# EAGLE design leo_shield (EAGLE 7.1.0)
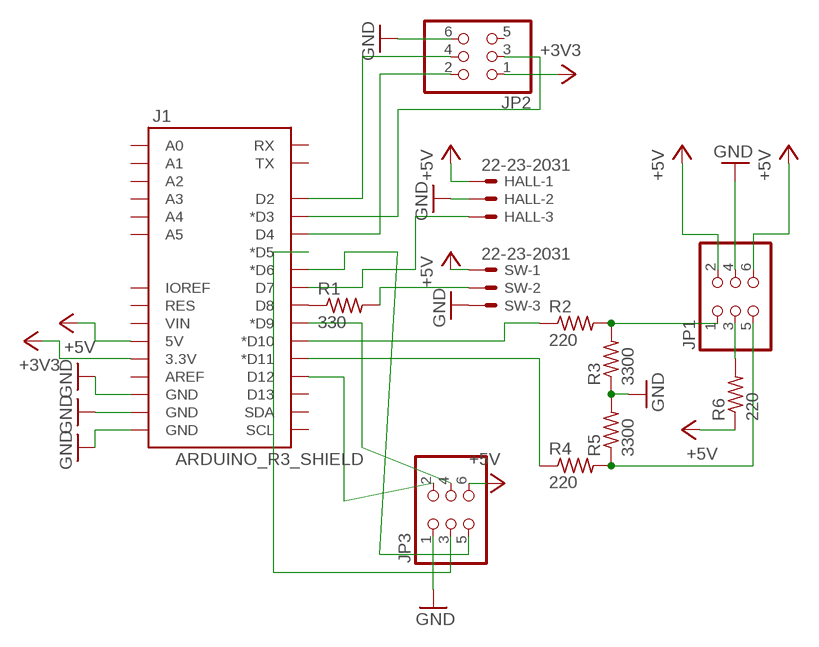
[diagram p0: schematic, sheet 1]

## Parts
HALL  22-23-2031  [22-23-2031]
J1  ARDUINO_R3_SHIELD  [UNO_R3_SHIELD]
JP1  PINHD-2X3  [2X03]
JP2  PINHD-2X3  [2X03]
JP3  PINHD-2X3  [2X03]
R1  330  R-US_0204/7  [0204/7]
R2  220  R-US_0204/7  [0204/7]
R3  3300  R-US_0204/7  [0204/7]
R4  220  R-US_0204/7  [0204/7]
R5  3300  R-US_0204/7  [0204/7]
R6  220  R-US_0204/7  [0204/7]
SW  22-23-2031  [22-23-2031]

## Nets
+3V3 [power]: J1.3.3V JP2.1
+5V [power]: HALL.1 J1.5V JP1.2 JP1.6 JP3.6 R6.1 SW.1
GND [power]: HALL.2 J1.GND@0(GND) J1.GND@1(GND) J1.GND@2(GND) JP1.4 JP2.6 JP3.1 R3.1 R5.2 SW.3
IR: JP1.1 R2.2 R3.2
N$1: J1.D12 JP3.2
N$2: JP1.3 R6.2
N$4: R1.2 SW.2
N$5: J1.D11(*D11) R4.1
N$6: J1.D8 R1.1
N$7: HALL.3 J1.D7
N$8: JP1.5 R4.2 R5.1
N$10: J1.D4 JP2.2
N$11: J1.D2 JP2.4
N$12: J1.D3(*D3) JP2.3
N$13: J1.D10(*D10) R2.1
N$14: J1.D9(*D9) JP3.4
N$15: J1.D5(*D5) JP3.3
N$16: J1.D6(*D6) JP3.5
Unconnected: J1.A0 J1.A1 J1.A2 J1.A3 J1.A4 J1.A5 J1.AREF J1.D13 J1.IOREF J1.RES J1.RX J1.SCL J1.SDA J1.TX J1.VIN JP2.5

## Library data of the parts
HALL SW = con-molex:22-23-2031: .100" (2.54mm) Center Header - 3 Pin; MF: MOLEX; MPN: 22-23-2031; OC_FARNELL: 1462950; OC_NEWARK: 30C0862
J1 = SparkFun-Boards:ARDUINO_R3_SHIELD: Shield form compatible with the Arduino Uno R3.
JP1-JP3 = pinhead:PINHD-2X3: PIN HEADER
R1-R6 = resistor:R-US_: RESISTOR, American symbol

## Net classes
1 power: width 0.914 mm, drill 0.406 mm, clearance 0.406 mm

## Board
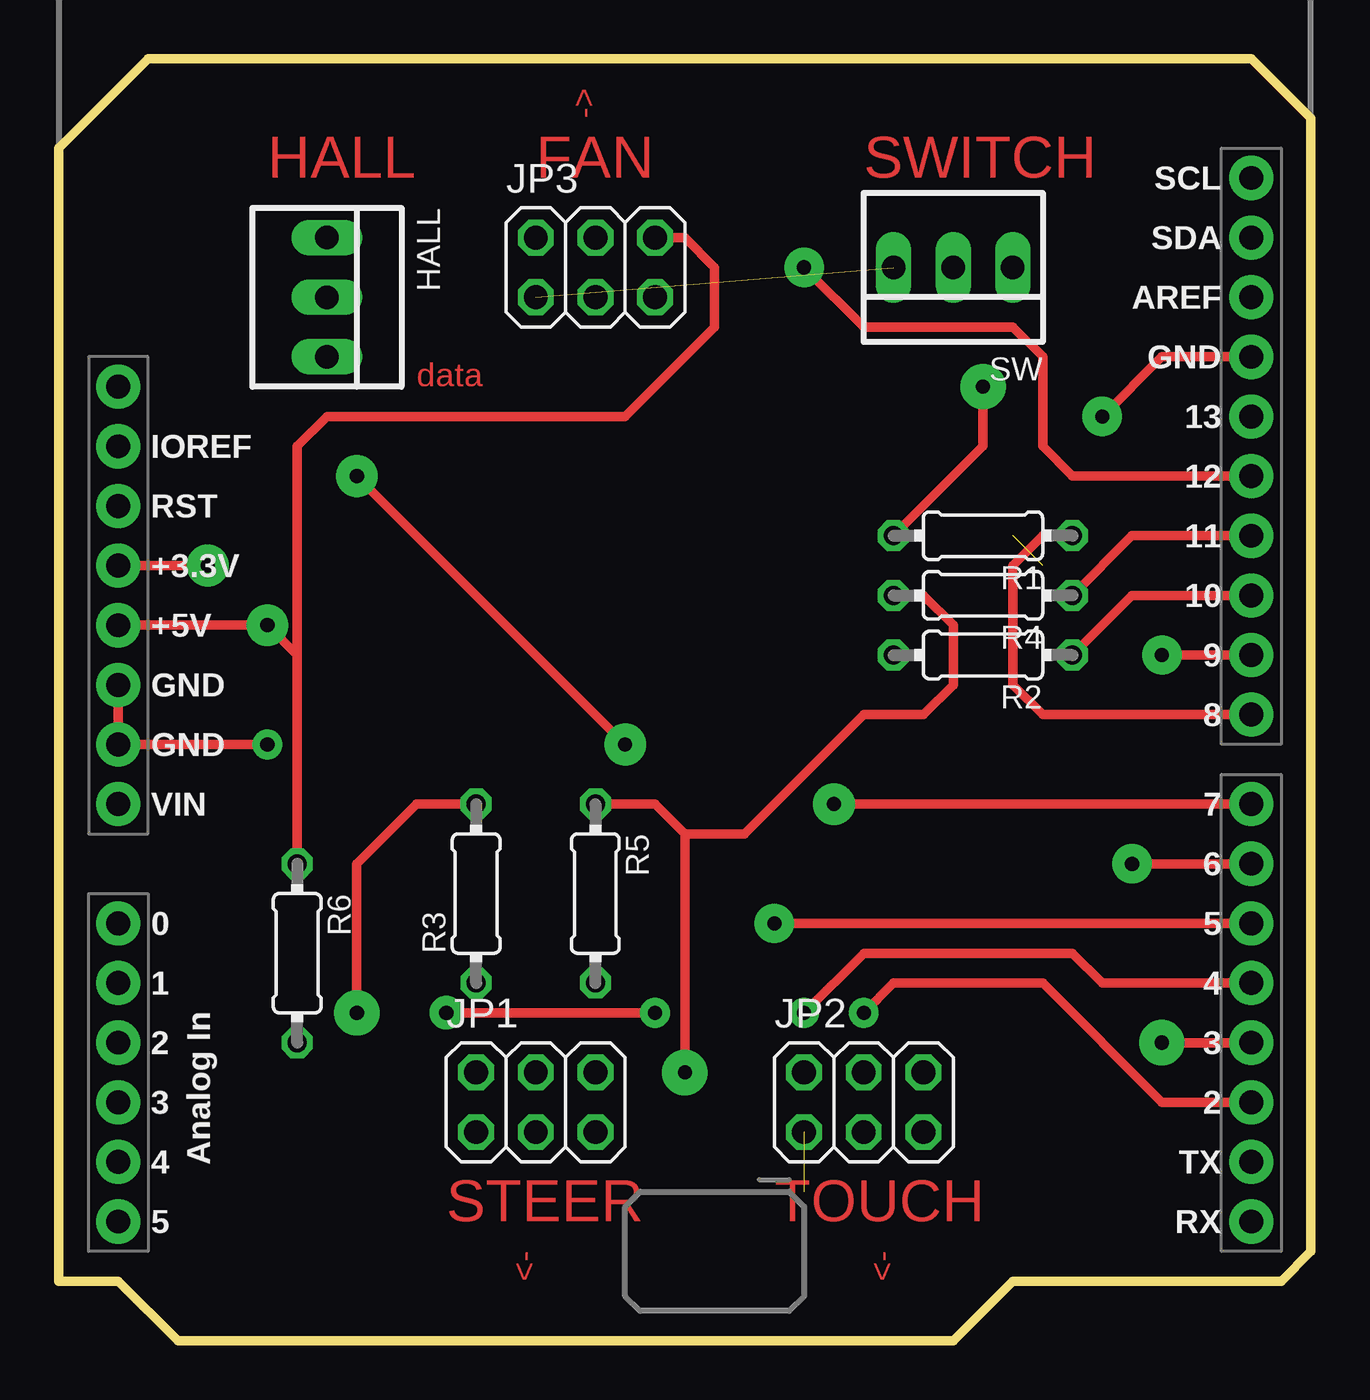
[diagram p1: board, top side]
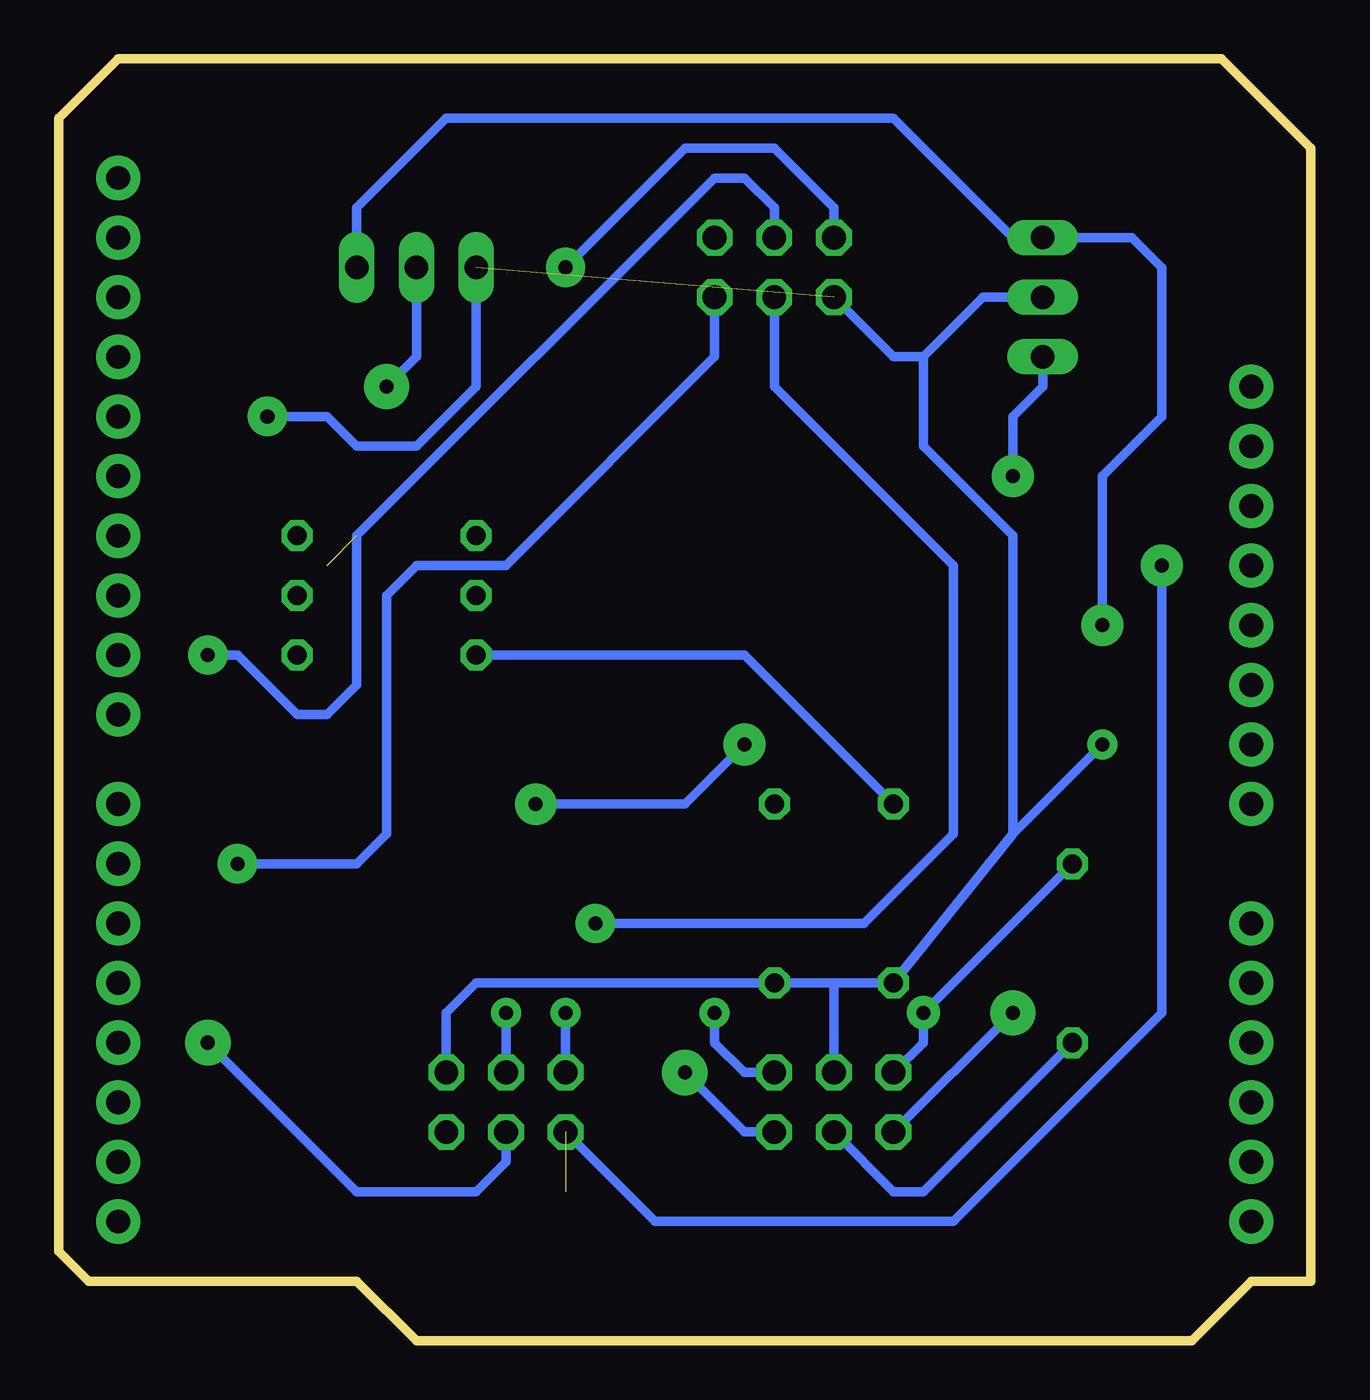
[diagram p2: board, bottom side, seen from below]

Size 53.34 x 54.61 mm. Coordinates in mm from the lower left corner, seen from the top.
Outline: 0,50.8 0,2.54 2.54,2.54 5.08,0 38.1,0 40.64,2.54 52.07,2.54 53.34,3.81 53.34,52.07 50.8,54.61 3.81,54.61 0,50.8
Copper layers (1*16): Top 0.035mm / dielectric 1.5mm / Bottom 0.035mm
Design rules "default": minimum track width 10mil, minimum drill 24mil, track to track 8mil, track to pad 8mil, pad to pad 8mil, via to via 8mil, smd to smd 8mil, copper to edge 40mil, drill to drill 8mil, minimum pad ring 10mil, minimum via ring 8mil, stop-mask expansion 4mil, vias tented up to drill 0mil, thermal gap 10mil

### Footprints (pad centres in the part's own frame; a part is rotated, then mirrored left to right if it is on the bottom)
22-23-2031 = drill 1 long: 1 -2.54,0; 2 0,0; 3 2.54,0
UNO_R3_SHIELD = drill 1.016 pad 1.88: 3.3V 50.8,26.67; 5V 50.8,29.21; A0 50.8,41.91; A1 50.8,44.45; A2 50.8,46.99; A3 50.8,49.53; A4 50.8,52.07; A5 50.8,54.61; AREF 2.54,15.24; D2 2.54,49.53; D3 2.54,46.99; D4 2.54,44.45; D5 2.54,41.91; D6 2.54,39.37; D7 2.54,36.83; D8 2.54,33.02; D9 2.54,30.48; D10 2.54,27.94; D11 2.54,25.4; D12 2.54,22.86; D13 2.54,20.32; GND@0 50.8,31.75; GND@1 50.8,34.29; GND@2 2.54,17.78; IOREF 50.8,21.59; NC 50.8,19.05; RES 50.8,24.13; RX 2.54,54.61; SCL 2.54,10.16; SDA 2.54,12.7; TX 2.54,52.07; VIN 50.8,36.83
2X03 = drill 1.016 octagon: 1 -2.54,-1.27; 2 -2.54,1.27; 3 0,-1.27; 4 0,1.27; 5 2.54,-1.27; 6 2.54,1.27
0204/7 = drill 0.813 octagon: 1 -3.81,0; 2 3.81,0

### Placement (x,y rotation side)
HALL  11.43,44.45 270 top
J1  53.34,59.69 180 top
JP1  20.32,10.16 0 top
JP2  34.29,10.16 0 top
JP3  22.86,45.72 0 top
R1  39.37,34.29 180 top
R2  39.37,29.21 180 top
R3  17.78,19.05 90 top
R4  39.37,31.75 180 top
R5  22.86,19.05 270 top
R6  10.16,16.51 270 top
SW  38.1,45.72 180 top

### Tracks (layer width: path | path; a pad name or v marks a point on that pad's centre or on a via)
+3V3  (via drill 0.6 pad 1.78)  (1 unrouted)
  Top 0.406: v6.35,33.02 J1.3.3V
  Bottom 0.406: v6.35,33.02 6.35,13.97 15.24,5.08 27.94,5.08 JP2.1
+5V  (via drill 0.6 pad 1.27, 0.6 pad 1.42, 0.6 pad 1.78)
  Top 0.406: J1.5V v8.89,30.48 10.16,29.21 R6.1 10.16,38.1 11.43,39.37 24.13,39.37 27.94,43.18 27.94,45.72 26.67,46.99 JP3.6 | v16.51,13.97 v25.4,13.97
  Bottom 0.406: v8.89,30.48 8.89,36.83 6.35,39.37 6.35,45.72 7.62,46.99 HALL.1 12.7,46.99 17.78,52.07 36.83,52.07 40.64,48.26 SW.1 | v25.4,13.97 25.4,12.7 24.13,11.43 JP1.6 | R6.1 v16.51,13.97 16.51,12.7 JP1.2
GND  (via drill 0.6 pad 1.27, 0.6 pad 1.68)  (1 unrouted)
  Top 0.406: v8.89,25.4 J1.GND@1 J1.GND@0 | J1.GND@2 46.99,41.91 v44.45,39.37
  Bottom 0.406: 12.7,21.59 R3.1 20.32,15.24 | v8.89,25.4 12.7,21.59 | 12.7,21.59 12.7,34.29 16.51,38.1 16.51,41.91 | HALL.2 13.97,44.45 16.51,41.91 | JP2.6 36.83,13.97 35.56,15.24 R5.2 20.32,15.24 | JP1.4 20.32,15.24 | SW.3 35.56,40.64 38.1,38.1 40.64,38.1 41.91,39.37 v44.45,39.37 | 16.51,41.91 17.78,41.91 JP3.1
IR  (via drill 0.6 pad 1.93)
  Top 0.406: R3.2 15.24,22.86 12.7,20.32 v12.7,13.97
  Bottom 0.406: v12.7,13.97 JP1.1 | R2.2 24.13,29.21 R3.2
N$1  (via drill 0.6 pad 1.68)
  Top 0.406: J1.D12 43.18,36.83 41.91,38.1 41.91,41.91 40.64,43.18 34.29,43.18 v31.75,45.72
  Bottom 0.406: v31.75,45.72 26.67,50.8 22.86,50.8 20.32,48.26 JP3.2
N$2
  Bottom 0.406: R6.2 16.51,6.35 17.78,6.35 JP1.3
N$4  (via drill 0.6 pad 1.93)
  Top 0.406: R1.2 39.37,38.1 v39.37,40.64
  Bottom 0.406: v39.37,40.64 38.1,41.91 SW.2
N$5
  Top 0.406: J1.D11 45.72,34.29 R4.1
N$6
  Top 0.406: R1.1 41.91,34.29 40.64,33.02 40.64,27.94 41.91,26.67 J1.D8
N$7  (via drill 0.6 pad 1.78)
  Top 0.406: J1.D7 v33.02,22.86 | v12.7,36.83 v24.13,25.4
  Bottom 0.406: v12.7,36.83 12.7,39.37 11.43,40.64 HALL.3 | v33.02,22.86 26.67,22.86 v24.13,25.4
N$8  (via drill 0.6 pad 1.93)
  Top 0.406: v26.67,11.43 26.67,21.59 | 26.67,21.59 25.4,22.86 R5.1 | 26.67,21.59 29.21,21.59 34.29,26.67 36.83,26.67 38.1,27.94 38.1,30.48 36.83,31.75 R4.2
  Bottom 0.406: JP1.5 24.13,8.89 v26.67,11.43
N$10  (via drill 0.6 pad 1.27)
  Top 0.406: J1.D4 44.45,15.24 43.18,16.51 34.29,16.51 v31.75,13.97
  Bottom 0.406: v31.75,13.97 JP2.2
N$11  (via drill 0.6 pad 1.27)
  Top 0.406: J1.D2 46.99,10.16 41.91,15.24 35.56,15.24 v34.29,13.97
  Bottom 0.406: v34.29,13.97 JP2.4
N$12  (via drill 0.6 pad 1.93)
  Top 0.406: J1.D3 v46.99,12.7
  Bottom 0.406: v46.99,12.7 40.64,6.35 35.56,6.35 34.29,7.62 JP2.3
N$13
  Top 0.406: J1.D10 45.72,31.75 R2.1
N$14  (via drill 0.6 pad 1.68)  (1 unrouted)
  Top 0.406: J1.D9 v46.99,29.21
  Bottom 0.406: JP3.4 22.86,48.26 24.13,49.53 25.4,49.53 40.64,34.29 40.64,27.94 41.91,26.67 43.18,26.67 45.72,29.21 v46.99,29.21
N$15  (via drill 0.6 pad 1.68)
  Top 0.406: J1.D5 v30.48,17.78
  Bottom 0.406: v30.48,17.78 19.05,17.78 15.24,21.59 15.24,33.02 22.86,40.64 JP3.3
N$16  (via drill 0.6 pad 1.68)
  Top 0.406: J1.D6 v45.72,20.32
  Bottom 0.406: v45.72,20.32 40.64,20.32 39.37,21.59 39.37,31.75 38.1,33.02 34.29,33.02 25.4,41.91 JP3.5

### Text on the board
Top: -> | HALL | FAN | SWITCH | data | STEER | TOUCH | <- | <-